# EAGLE design V2 (EAGLE 9.6.2)
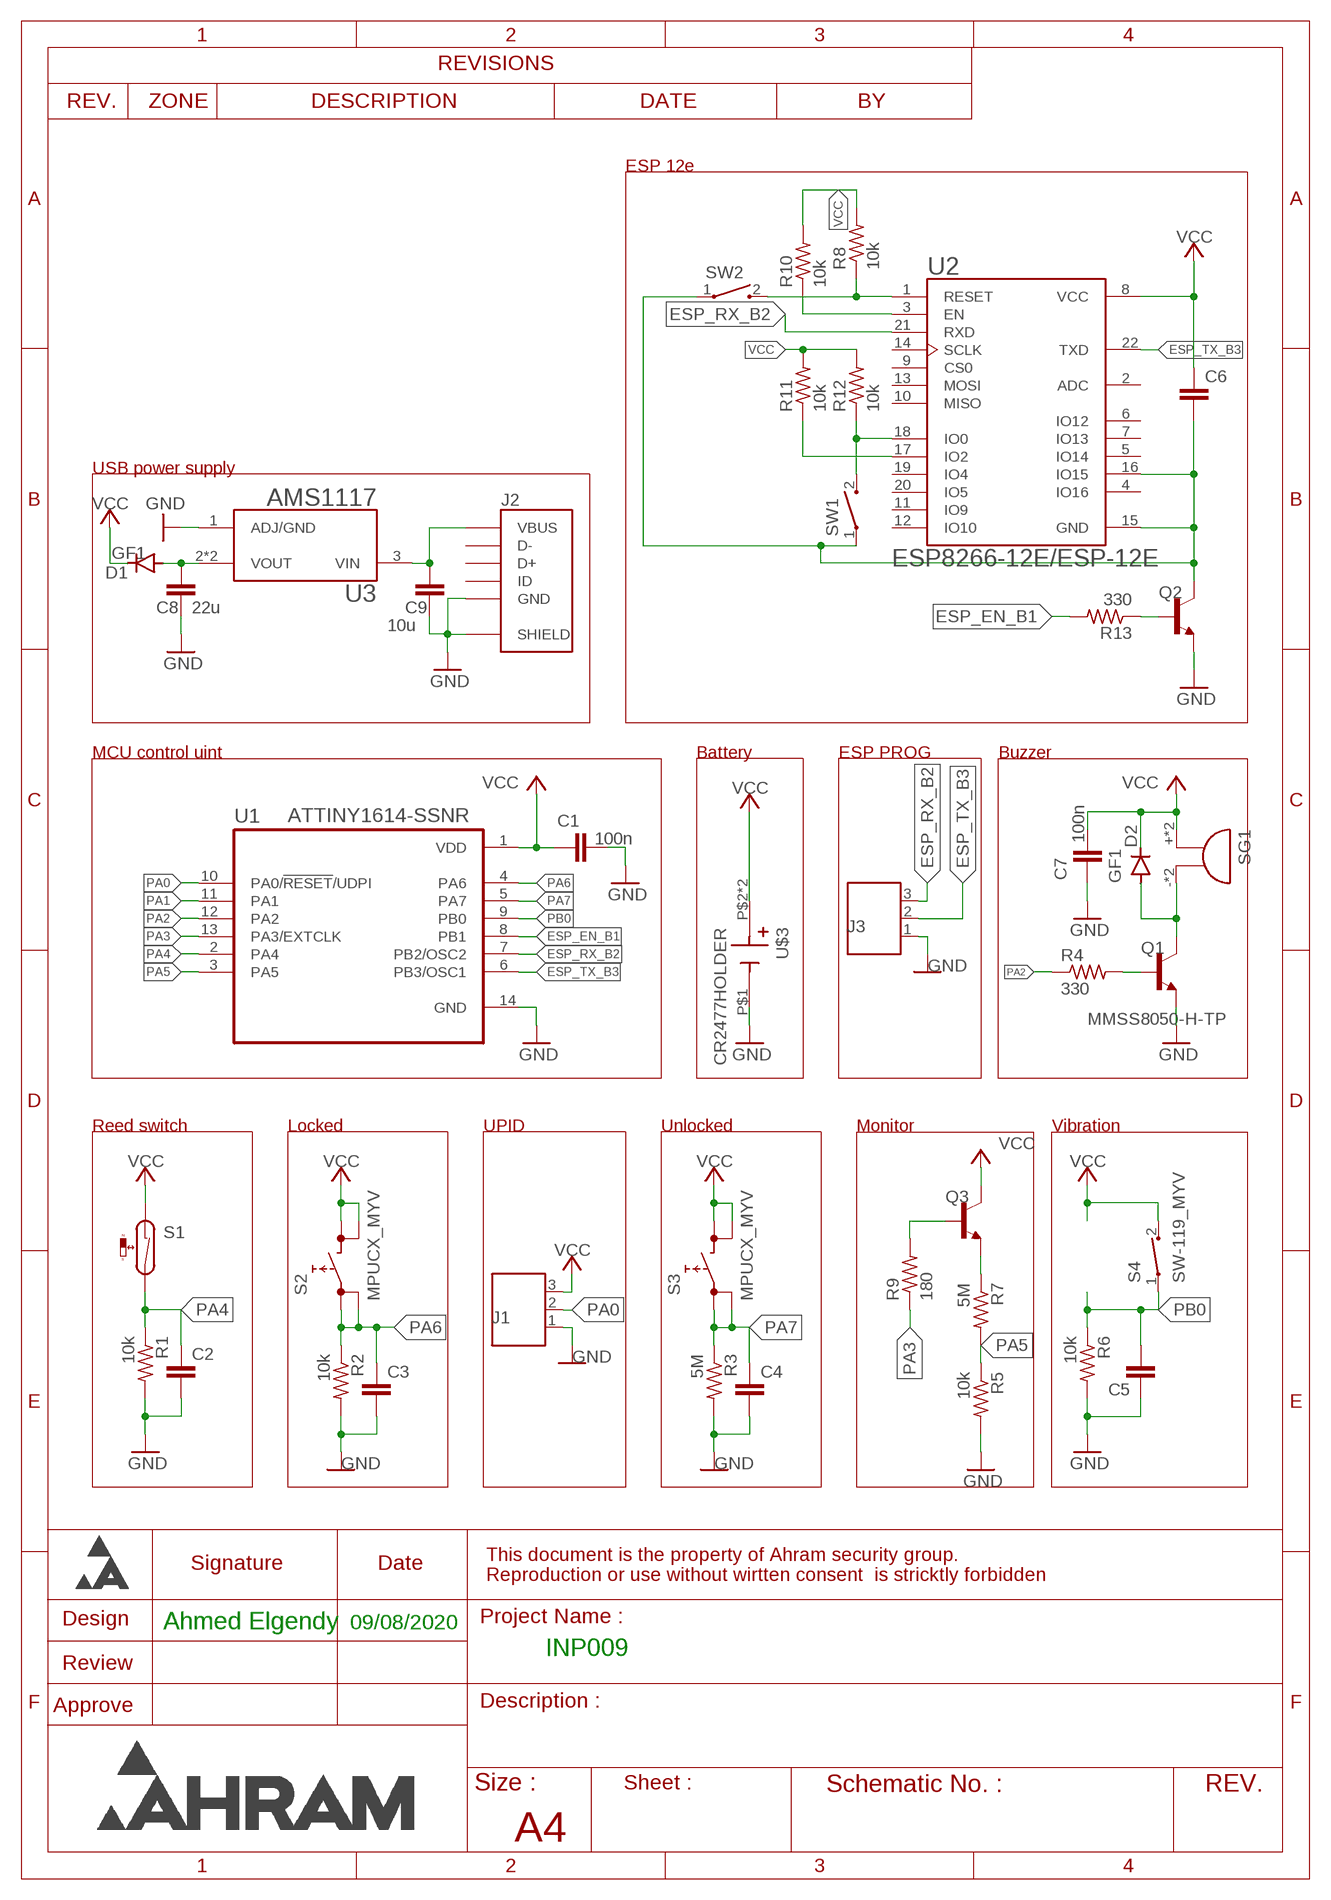
[diagram p0: schematic, sheet 1]

## Parts
C1  100n  C-EUC0805K  [C0805K]
C2  C-EUC0805K  [C0805K]
C3  C-EUC0805K  [C0805K]
C4  C-EUC0805K  [C0805K]
C5  C-EUC0805K  [C0805K]
C6  C-EUC0805K  [C0805K]
C7  100n  C-EUC0805K  [C0805K]
C8  22u  C-EUC0805K  [C0805K]
C9  10u  C-EUC0805K  [C0805K]
D1  GF1  [SMA-DO214AC]
D2  GF1  [SMA-DO214AC]
J1  691508110303  [691508110303]
J2  USB3065-XX-00-A_REVE  [GCT_USB3065-XX-00-A_REVE]
J3  691508110303  [691508110303]
Q1  MMSS8050-H-TP  [TRANS_MMSS8050-H-TP]
Q2  MMSS8050-H-TP  [TRANS_MMSS8050-H-TP]
Q3  MMSS8050-H-TP  [TRANS_MMSS8050-H-TP]
R1  10k  R-US_M0805  [M0805]
R2  10k  R-US_M0805  [M0805]
R3  5M  R-US_M0805  [M0805]
R4  330  R-US_M0805  [M0805]
R5  10k  R-US_M0805  [M0805]
R6  10k  R-US_M0805  [M0805]
R7  5M  R-US_M0805  [M0805]
R8  10k  R-US_M0805  [M0805]
R9  180  R-US_M0805  [M0805]
R10  10k  R-US_M0805  [M0805]
R11  10k  R-US_M0805  [M0805]
R12  10k  R-US_M0805  [M0805]
R13  330  R-US_M0805  [M0805]
S1  RI80SMDM-MYV  [RI80SMDM-0510-J1]
S2  MPUCX_MYV  [MPUCX_MYV]
S3  MPUCX_MYV  [MPUCX_MYV]
S4  SW-119_MYV  [SW-119]
SG1  CMI-9653S-SMT  [SMD_BUZZER]
SW1  1437566-3  [SW_1437566-3]
SW2  1437566-3  [SW_1437566-3]
U1  ATTINY1614-SSNR  [SOIC127P600X175-14N]
U2  ESP8266-12E/ESP-12E  [XCVR_ESP8266-12E/ESP-12E]
U3  AMS1117  [SOT229P700X180-4N]
U$3  CR2477HOLDER  [CR2477]

## Nets
ESP_EN_B1 [dd]: R13.2 U1.8(PB1)
ESP_RX_B2 [dd]: J3.3 U1.7(PB2/OSC2) U2.21(RXD)
ESP_TX_B3 [dd]: J3.2 U1.6(PB3/OSC1) U2.22(TXD)
GND [dd]: C1.2 C2.2 C3.2 C4.2 C5.1 C7.1 C8.1 C9.1 J1.1 J2.5(GND) J2.6(SHIELD) J2.7(SHIELD) J2.8(SHIELD) J2.9(SHIELD) J3.1 Q1.2(E) Q2.2(E) R1.2 R2.2 R3.2 R5.2 R6.2 U1.14(GND) U3.1(ADJ/GND) U$3.P$1(-)
N$2 [dd]: D2.A Q1.3(C) SG1.- SG1.--(-)
N$3 [dd]: C9.2 J2.1(VBUS) U3.3(VIN)
N$4 [dd]: Q1.1(B) R4.2
N$5 [dd]: C8.2 D1.A U3.2(VOUT) U3.4(VOUT)
N$6 [dd]: Q3.1(B) R9.2
N$7 [dd]: Q2.1(B) R13.1
N$8 [dd]: C6.2 Q2.3(C) SW1.1 SW2.1 U2.15(GND) U2.16(IO15)
N$9 [dd]: R12.1 SW1.2 U2.18(IO0)
N$10 [dd]: R11.1 U2.17(IO2)
N$11 [dd]: R10.1 U2.3(EN)
N$12 [dd]: R8.1 SW2.2 U2.1(RESET)
NS3 [dd]: Q3.2(E) R7.1
PA0 [dd]: J1.2 U1.10(PA0/!RESET!/UDPI)
PA1 [dd]: U1.11(PA1)
PA2 [dd]: R4.1 U1.12(PA2)
PA3 [dd]: R9.1 U1.13(PA3/EXTCLK)
PA4 [dd]: C2.1 R1.1 S1.P$2 U1.2(PA4)
PA5 [dd]: R5.1 R7.2 U1.3(PA5)
PA6 [dd]: C3.1 R2.1 S2.1 S2.2 U1.4(PA6)
PA7 [dd]: C4.1 R3.1 S3.1 S3.2 U1.5(PA7)
PB0 [dd]: C5.2 R6.1 S4.1 U1.9(PB0)
VCC [dd]: C1.1 C6.1 C7.2 D1.K(C) D2.K(C) J1.3 Q3.3(C) R8.2 R10.2 R11.2 R12.2 S1.P$1 S2.3 S2.4 S3.3 S3.4 S4.2 SG1.+ SG1.++(+) U1.1(VDD) U2.8(VCC) U$3.P$2(+) U$3.P$3(+)
Unconnected: J2.2(D-) J2.3(D+) J2.4(ID) U2.2(ADC) U2.4(IO16) U2.5(IO14) U2.6(IO12) U2.7(IO13) U2.9(CS0) U2.10(MISO) U2.11(IO9) U2.12(IO10) U2.13(MOSI) U2.14(SCLK) U2.19(IO4) U2.20(IO5)

## Notes on the sheet
- ESP 12e
- USB power supply
- MCU control uint | Battery | ESP PROG | Buzzer
- Reed switch | Locked | UPID | Unlocked | Monitor | Vibration
- Ahmed Elgendy | 09/08/2020
- INP009

## Library data of the parts
C1-C9 = rcl:C-EU: CAPACITOR, European symbol; SPICEPREFIX: C
D1 D2 = diode:GF1: DIODE
J1 J3 = Wurth_Elektronik_Electromechanic_Terminal_Blocks_Connectors_rev16b:691508110303: WR-TBL Terminal block - serie 5081 - 3 Pins;=>Code : Con_TBL_Screw_PClamp_3.50_6915081103xx_691508110303 <http://katalog.we-online.de/media/images/eican/Con_TBL_Screw_PClamp_3.50_6915081103xx_pf2.jpg> Details see: http://katalog.we-online.de/em/datasheet/6915081103xx.pdf Created 11/3/2014, Karrer Zheng 2014 (C) Wurth Elektronik
J2 = USB3065-XX-00-A_REVE:USB3065-XX-00-A_REVE: Micro USB Receptacle, Type B, 5 Pin, SMT, Horizontal, Bottom Mount (Standart), Optional Plastic Locating Peg; AVAILABILITY: Unavailable; DESCRIPTION: USB3065 Series 5 Pin, SMT, Horizontal, Bottom Mount, Micro USB Receptacle; MF: Global Connector Technology; MP: USB3065-30-00-A; PACKAGE: None; PRICE: None
Q1-Q3 = MMSS8050-H-TP:MMSS8050-H-TP: MMSS8050-H Series 25 V 1.5 A NPN Silicon Plastic-Encapsulate Transistor-SOT-23; AVAILABILITY: Unavailable; DESCRIPTION: Bipolar _BJT_ Transistor NPN 25V 1.5A 100MHz 625mW Surface Mount SOT-23; MF: Micro Commercial; MP: MMSS8050-H-TP; PACKAGE: SOT-23 Micro Commercial; PRICE: None
R1-R13 = rcl:R-US_: RESISTOR, American symbol; SPICEPREFIX: R
S1 = reed_MYV:RI80SMDM-MYV
S2 S3 = shouhan_BP:MPUCX_MYV
S4 = sw-119_MYV:SW-119_MYV
SG1 = CUI audio device:CMI-9653S-SMT
SW1 SW2 = 1437566-3:1437566-3: Switch Tactile OFF (ON) SPST Rectangular Button Gull Wing 0.05A 12VDC SMD Loose Piece Check prices <https://pricing.snapeda.com/parts/1437566-3/TE%20Connectivity/view-part?ref=eda>; AVAILABILITY: Warning; COMMENT: 1437566-3; CONFIGURATION_POLE-THROW: Single Pole - Single Throw; CONTACT_CURRENT_RATING: 50 mA; DESCRIPTION: Tactile Switch SPST-NO Top Actuated Surface Mount; MF: TE Connectivity; MP: 1437566-3; PACKAGE: None; PRICE: None
U1 = ATTINY1614-SSNR:ATTINY1614-SSNR: 20MHz, SOIC, 85C, Green, 14 SOIC .150in T/R; ARROW_ELECTRONICS-PURCHASE-URL: https://snapeda.com/shop?store=Arrow+Electronics&id=4817174; AVAILABILITY: Unavailable; DESCRIPTION: IC MCU 8BIT 16KB FLASH 14SOIC; DIGIKEY-PURCHASE-URL: https://snapeda.com/shop?store=DigiKey&id=4817174; MF: Microchip Technology; MOUSER-PURCHASE-URL: https://snapeda.com/shop?store=Mouser&id=4817174; MP: ATTINY1614-SSNR; PACKAGE: None; PRICE: None
U2 = ESP8266-12E_ESP-12E:ESP8266-12E/ESP-12E: ESP-12E WiFi Module; AVAILABILITY: Unavailable; DESCRIPTION: This WiFi module has a 32-bit MCU micro and clock speeds supporting 80 MHz or 160 MHz. Supports the RTOS and integrated Wi-Fi MAC/BB/RF/PA/LNA, and has an on-board antenna.; MF: AI-Thinker; MP: ESP8266-12E/ESP-12E; PACKAGE: None; PRICE: None
U3 = AMS1117:AMS1117: Sot223/Pkg 1-Amp 5-Volt Low Drop Out Voltage Regulatator; AVAILABILITY: Unavailable; DESCRIPTION: UNO PLUS Arduino R3 Shield, Xbee Arduino IDE Wheeled Robotics Kit; MF: Seeed Technology; MP: AMS1117; PACKAGE: SOT-223 Seeed Technology; PRICE: None
U$3 = cr2477_MYV:CR2477HOLDER

## Net classes
0 default: width 0.254 mm, clearance 0.254 mm
1 dd: width 0.254 mm, clearance 0.254 mm

## Board
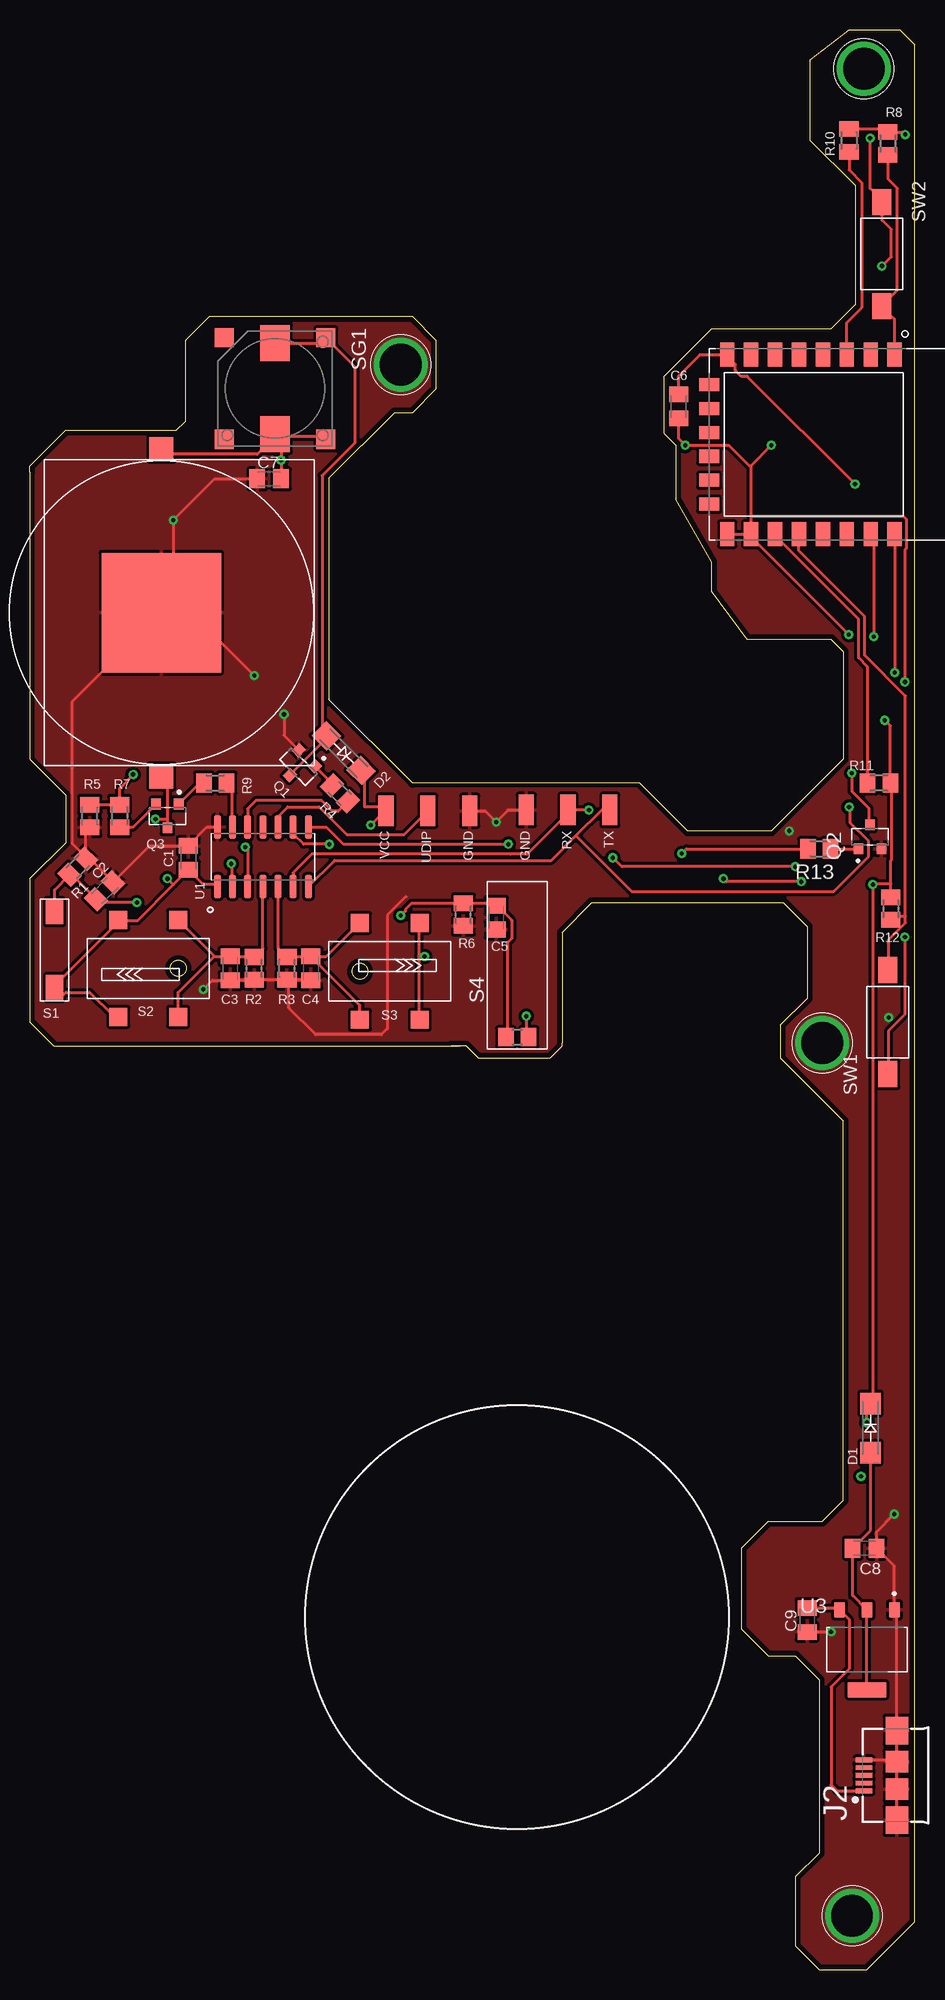
[diagram p1: board, top side]
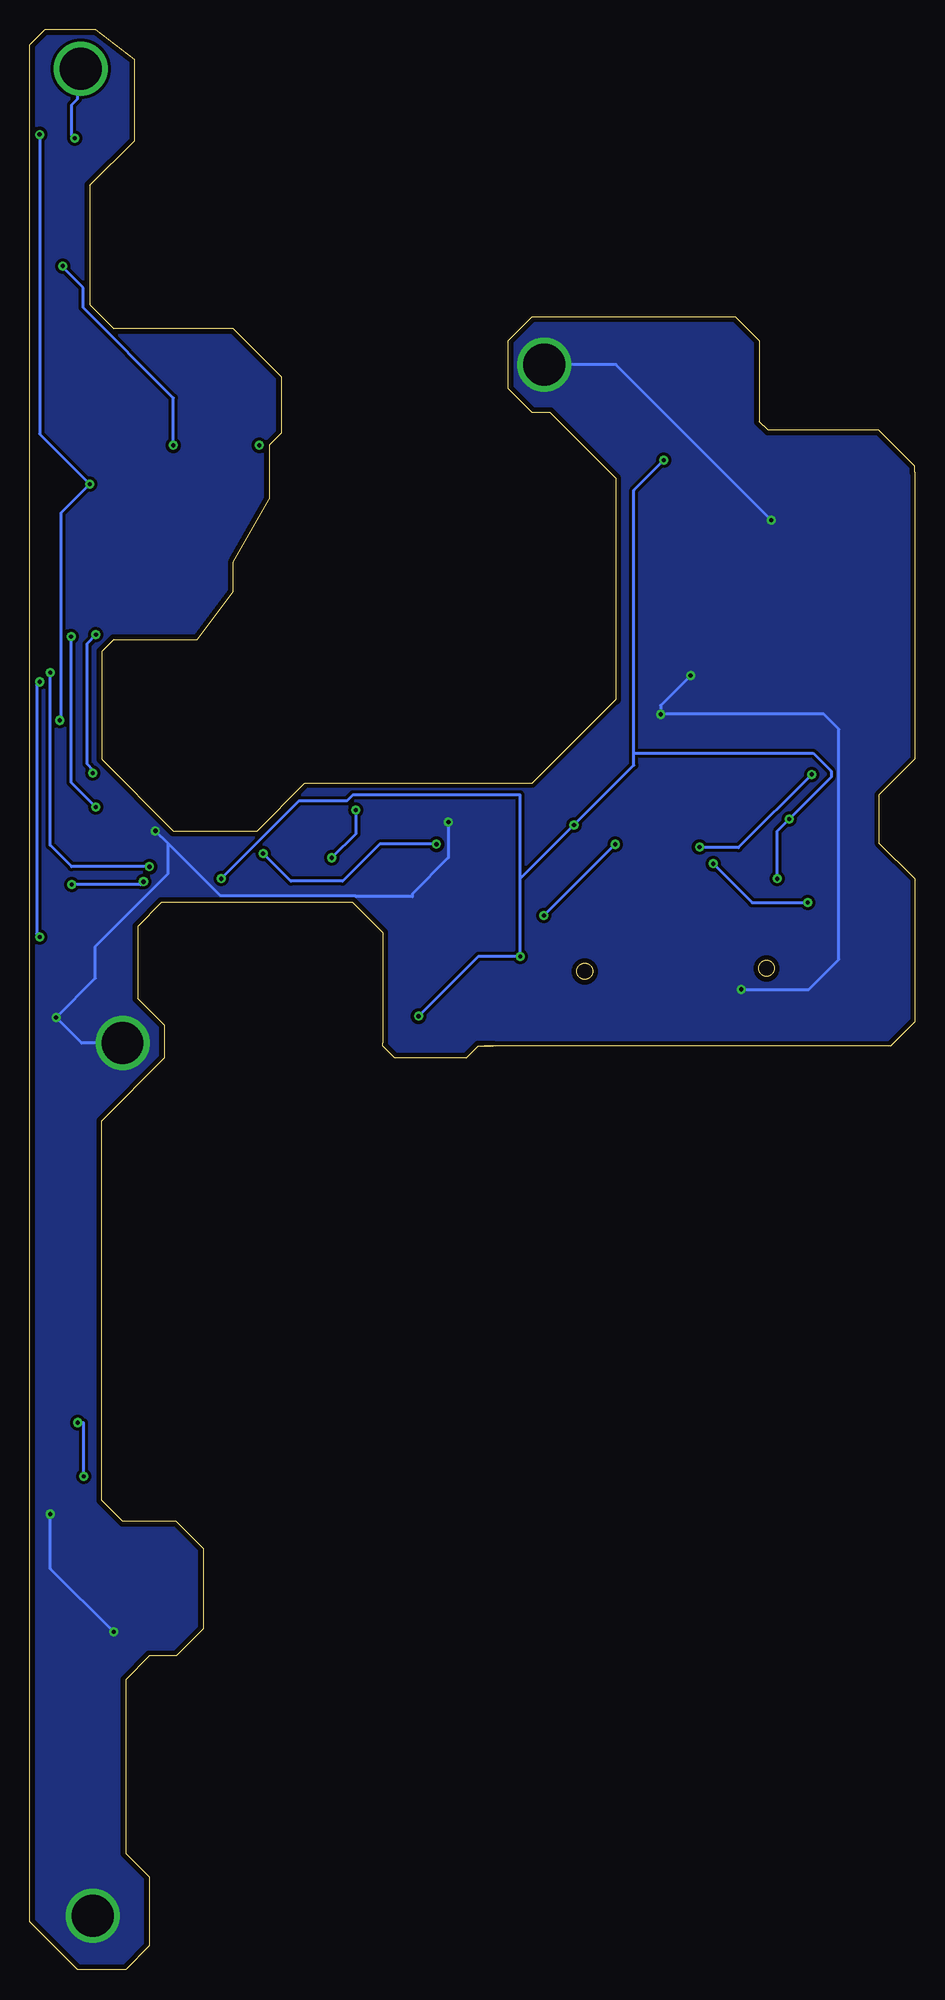
[diagram p2: board, bottom side, seen from below]

Size 74 x 162.25 mm. Coordinates in mm from the lower left corner, seen from the top.
Outline: 35.25,77.25 2,77.25 0,79.25 0,91.25 3,94.25 3,98.25 0,101.25 0,125.25 0,125.75 3,128.75 12.25,128.75 13,129.5 13,136.25 15,138.25 32,138.25 34,136.25 34,132.25 32,130.25 30.5,130.25 25,124.75 25,106.25 32,99.25 51,99.25 55,95.25 62,95.25 68,101.25 68,110.25 67,111.25 60,111.25 57,115.25 57,117.75 54,123 54,127.5 53,128.5 53,133.25 57,137.25 67,137.25 69,139.25 69,149.25 65.25,153 65.25,159.75 68.5,162.25 72.75,162.25 74,161 74,4 70,0 66,0 64,2 64,7.75 66,9.75 66,24.25 64,26.25 61.75,26.25 59.5,28.5 59.5,35.25 61.75,37.5 66.25,37.5 68,39.25 68,71 62.75,76.25 62.75,79 65,81.25 65,87.25 63,89.25 47,89.25 44.5,86.75 44.5,77.5 44.5,77.25 43.5,76.25 43.25,76.25 37.5,76.25 36.5,77.25 35.25,77.25
Outline: 35.25,77.25 36,77.25
Outline: circle at 12.4,83.75 radius 0.65
Outline: circle at 27.6,83.5 radius 0.65
Copper layers (1*16): Top 0.035mm / dielectric 1.5mm / Bottom 0.035mm
Design rules "default *": minimum track width 10mil, minimum drill 0.35mm, track to track 10mil, track to pad 10mil, pad to pad 10mil, via to via 10mil, smd to smd 10mil, copper to edge 15mil, drill to drill 10mil, minimum pad ring 10mil, minimum via ring 8mil, stop-mask expansion 4mil, vias tented up to drill 0mil, thermal gap 10mil

### Footprints (pad centres in the part's own frame; a part is rotated, then mirrored left to right if it is on the bottom)
C0805K = smd 1.3 x 1.6: 1 -1,0; 2 1,0
SMA-DO214AC = smd 1.8 x 1.7: A -2.05,0; K 2.05,0
691508110303 = smd 1.27 x 2.54: 1 -3.5,0; 2 0,0; 3 3.5,0
GCT_USB3065-XX-00-A_REVE = smd 0.4 x 1.4: 1 -1.3,0.5; 2 -0.65,0.5; 3 0,0.5; 4 0.65,0.5; 5 1.3,0.5 | smd 1.8 x 1.9: 6 1.15,-2.25; 7 -1.15,-2.25 | smd 2.3 x 1.9: 8 3.75,-2.25; 9 -3.75,-2.25
TRANS_MMSS8050-H-TP = smd 0.9 x 0.8: 1 -1,0.95; 2 -1,-0.95; 3 1,0
M0805 = smd 1.3 x 1.6: 1 -0.95,0; 2 0.95,0
RI80SMDM-0510-J1 = smd 2.1 x 1.45: P$1 -3,0; P$2 3.35,0
MPUCX_MYV = smd 1.5 x 1.5: 1 0.1,1.55; 2 0.1,-6.55; 3 5.1,1.55; 4 5.1,-6.55
SW-119 = smd 1.3 x 1.5: 1 -0.95,0; 2 0.95,0
SMD_BUZZER = smd 3 x 2.5: + 3.8,0; - -3.8,0 | smd 1.6 x 1.6: ++ 4.25,4.25; -- -4.25,4.25; N 4.25,-4.25; NC -4.25,-4.25
SW_1437566-3 = smd 2.18 x 1.6: 1 -4.346,0; 2 4.346,0
SOIC127P600X175-14N = smd 1.95 x 0.59: 1 -2.48,3.81; 2 -2.48,2.54; 3 -2.48,1.27; 4 -2.48,0; 5 -2.48,-1.27; 6 -2.48,-2.54; 7 -2.48,-3.81; 8 2.48,-3.81; 9 2.48,-2.54; 10 2.48,-1.27; 11 2.48,0; 12 2.48,1.27; 13 2.48,2.54; 14 2.48,3.81
XCVR_ESP8266-12E/ESP-12E = smd 2 x 1.2: 1 -7.5,7; 2 -7.5,5; 3 -7.5,3; 4 -7.5,1; 5 -7.5,-1; 6 -7.5,-3; 7 -7.5,-5; 8 -7.5,-7; 15 7.5,-7; 16 7.5,-5; 17 7.5,-3; 18 7.5,-1; 19 7.5,1; 20 7.5,3; 21 7.5,5; 22 7.5,7 | smd 1.1 x 1.7: 9 -5,-8.5; 10 -3,-8.5; 11 -1,-8.5; 12 1,-8.5; 13 3,-8.5; 14 5,-8.5
SOT229P700X180-4N = smd 1.31 x 0.93: 1 -3.345,2.29; 2 -3.345,0; 3 -3.345,-2.29 | smd 1.31 x 3.24: 4 3.345,0
CR2477 = smd 10 x 10: P$1 0,0 | smd 2 x 2: P$2 13.7,0; P$3 -13.7,0

### Placement (x,y rotation side)
C1  13.25,93 90 top
C2  6.25,90.25 45 top
C3  16.75,83.75 270 top
C4  23.5,83.75 270 top
C5  39,88 90 top
C6  54.25,130.75 270 top
C7  20,124.7 0 top
C8  69.8,35.25 180 top
C9  65,29.25 90 top
D1  70.3,45.3 90 top
D2  26.25,101.75 315 top
J1  33.28,96.93 180 top
J2  70.25,16.25 90 top
J3  45,97 0 top
Q1  22.45,100.62 225 top
Q2  70.25,94.75 90 top
Q3  11.5,96.5 270 top
R1  4,92.25 45 top
R2  18.75,83.75 270 top
R3  21.5,83.75 270 top
R4  25.92,98.39 135 top
R5  5,96.5 270 top
R6  36.25,88.25 270 top
R7  7.5,96.5 90 top
R8  71.75,152.75 90 top
R9  15.5,99.25 180 top
R10  68.5,153 90 top
R11  71,99.25 0 top
R12  72,88.75 90 top
R13  66,93.75 180 top
S1  2.06,85.14 90 top
S2  12.5,81.25 180 top
S3  27.5,86 0 top
S4  40.75,78 0 top
SG1  20.5,132.25 270 top
SW1  71.75,79.25 90 top
SW2  71.25,143.5 270 top
U1  19.48,93.08 90 top
U2  65.31,127.57 270 top
U3  70,26.75 270 top
U$3  11,113.5 90 top

### Tracks (layer width: path | path; a pad name or v marks a point on that pad's centre or on a via)
ESP_EN_B1  (via drill 0.35)
  Top 0.254: U1.8 24.79,95.56 26.22,94.13 v40,94.13 | R13.2 54.89,93.75 v54.51,93.37 v54.5,93.37
  Bottom 0.254: v40,94.13 44.75,94.13 47.84,91.04 52.17,91.04 v54.5,93.37
ESP_RX_B2  (via drill 0.35)
  Top 0.254: U1.7 25.47,92.78 43.61,92.78 45.67,94.84 | J3.3 47.82,97 45.67,94.84 | U2.21 70.56,119.82 v70.56,111.5 | 45.67,94.84 50.32,90.19 67.21,90.19 70.13,93.11 70.13,94.38 68.61,95.91 68.61,97.18 v68.5,97.25
  Bottom 0.254: v68.5,97.25 70.56,99.31 v70.56,111.5
ESP_TX_B3  (via drill 0.35)
  Top 0.254: U2.22 v72.31,108.5 | v64,92.25 49.5,92.25 v48.75,93 | v46.75,97 J3.2 45,96.73 41.58,93.31 40.2,93.31 40.19,93.29 23.56,93.29 22.02,91.75 U1.6
  Bottom 0.254: v72.31,108.5 72.31,94.06 70.5,92.25 v64,92.25 | v46.75,97 46.75,95 v48.75,93
GND  (via drill 0.35, 3.5)
  Top 0.254: J2.9 J2.7 J2.6 | 38.7,87.3 C5.1 | C9.1 v67,28.25 | v72.29,38.1 70.81,36.62 70.81,36.54 70.8,36.53 C8.1 72.29,33.76 U3.1 72.5,29.89 J2.8 J2.6 | J1.1 38.07,96.93 v39,96 40,97 J3.1 | v14.5,82 15.25,82.75 C3.2 18.7,82.75 R2.2 R3.2 21.65,82.8 | 21.65,82.8 23.45,82.8 C4.2 | C7.1 15.45,124.7 v12,121.25 12,114.5 U$3.P$1 | U$3.P$1 13.5,113.5 v18.75,108.25 | U$3.P$1 3.51,106.01 3.51,94.21 4.8,92.92 | U1.14 14.81,95.56 C1.2 10,94 C2.2 4.99,92.92 4.8,92.92 | v21.25,105 21.25,103.23 Q1.2 | J2.5 72.35,17.55 J2.6 | 31.45,89.75 29.9,88.2 29.9,78.7 29.4,78.2 23.9,78.2 21.65,80.45 21.65,82.8 | R5.2 4.67,95.22 R1.2 4.8,92.92
  Bottom 0.254: v67,28.25 72.29,33.54 v72.29,38.1 | v66.25,77.5 69.66,77.5 v71.81,79.65 68.53,82.93 68.53,85.59 62.45,91.66 62.45,94.2 | 62.45,94.2 v63.5,95.25 | v39,96 39,93 42,90 42,89.75 46.71,89.75 46.77,89.81 58.06,89.81 62.45,94.2 | v12,121.25 25,134.25 v31,134.25 | v18.75,108.25 21.25,105.75 v21.25,105 7.6,105 6.35,103.75 6.35,84.5 8.85,82 v14.5,82
  other vias: 68.75,4.5
  pour Top: 74,162.25 74,0 0,0 0,162.25
  pour Bottom: 74,162.25 74,-0.07 11.07,-0.07 11,0 0,0 0,162.25
N$2
  Top 0.254: SG1.- 24.3,136.05 SG1.-- 27.15,134.1 27.15,127.69 24.44,124.98 24.44,103.56 D2.A 24.8,102.97 Q1.3
N$3
  Top 0.254: C9.2 67.56,30.25 U3.3 68.5,29.31 68.5,25.15 67,23.65 67,15.45 67.5,14.95 J2.1
N$4
  Top 0.254: Q1.1 25.25,99.24 R4.2
N$5
  Top 0.254: U3.4 U3.2 68.8,31.3 C8.2 70.3,36.75 D1.A
N$6
  Top 0.254: Q3.1 14.2,99.25 R9.2
N$7
  Top 0.254: Q2.1 69.24,93.75 R13.1
N$8  (via drill 0.35, 3.5)
  Top 0.254: U2.15 U2.16 | U2.16 60.31,121.56 | 60.31,121.56 60.31,125.65 | 60.31,125.65 60.31,125.81 v62,127.5 | C6.2 54.25,128.06 v54.81,127.5 55.8,127.5 55.8,127.51 58.46,127.51 60.31,125.65 | v68.73,100.1 68.73,98.57 70.13,97.18 70.13,95.78 Q2.3 | v68.48,111.66 60.1,120.04 U2.16 | v73.18,86.38 73.18,79.91 71.78,78.51 71.78,74.95 SW1.1 | v73.18,107.72 73.18,118.77 73.31,118.9 73.31,121.31 73.05,121.56 60.31,121.56 | v71.25,142.5 71.27,142.52 72.03,143.28 72.03,145.56 71.27,146.33 71.27,147.72 SW2.1 71.27,147.98 70.26,148.99 v70.26,153.19
  Bottom 0.254: v62,127.5 62,131.46 69.56,139.02 69.56,140.68 71.15,142.26 71.15,142.39 v71.25,142.5 | 70.05,158.7 v69.75,159 70,158.65 70,156.49 70.51,155.98 70.51,153.44 v70.26,153.19 | v68.73,100.1 68.73,100.35 69.24,100.86 69.24,110.89 v68.48,111.66 | v73.18,86.38 73.43,86.64 73.43,107.47 v73.18,107.72
N$9
  Top 0.254: R12.1 72.33,88.13 73.21,88.13 | U2.18 64.31,118.67 69.8,113.18 69.8,109.94 73.21,106.53 73.21,88.13 | 73.21,88.13 73.21,87.54 72,86.34 71.91,86.26 71.78,86.13 71.78,83.72 SW1.2
N$10
  Top 0.254: R11.1 70.05,108.97 69.29,109.72 69.29,112.95 62.31,119.94 U2.17
N$11
  Top 0.254: R10.1 68.5,150.54 69.56,149.48 69.56,139.02 68.31,137.77 U2.3
N$12
  Top 0.254: R8.1 71.78,151.79 71.78,149.76 72.54,148.99 72.54,140.49 71.27,139.22 SW2.2 71.27,139.09 72.29,138.07 72.29,135.15 U2.1
NS3
  Top 0.254: Q3.2 8.6,95.55 R7.1
PA0
  Top 0.254: U1.10 20.75,96.46 21.55,97.26 24.19,97.26 26.5,94.95 31.3,94.95 J1.2
PA2
  Top 0.254: R4.1 25.77,96.9 25.27,96.9 24.4,97.77 18.87,97.77 18.21,97.11 U1.12
PA3
  Top 0.254: U1.13 16.94,98.76 R9.1
PA4  (via drill 0.35)
  Top 0.254: S1.P$2 2.06,90.31 R1.1 3.51,91.58 C2.1 5.84,89.25 v8.95,89.25 | U1.2 16.94,92.41 v16.85,92.5
  Bottom 0.254: v16.85,92.5 13.6,89.25 v8.95,89.25
PA5  (via drill 0.35)
  Top 0.254: R5.1 R7.2 7.5,98.8 8.65,99.95 v8.62,99.97 | v18,93.9 18.21,93.69 U1.3
  Bottom 0.254: v8.62,99.97 14.75,93.85 18,93.85 v18,93.9
PA6
  Top 0.254: S2.1 12.4,81.75 15.4,84.75 C3.1 | S2.2 15.45,84.75 C3.1 | C3.1 18.7,84.75 R2.1 19.48,85.43 U1.4
PA7
  Top 0.254: U1.5 20.75,85.45 R3.1 21.55,84.75 C4.1 | C4.1 24.8,84.75 S3.1 | S3.2 27.6,80.65 C4.1
PB0  (via drill 0.35)
  Top 0.254: S4.1 39.9,78 39.9,85.88 40.28,86.26 40.28,87.78 39.02,89.05 C5.2 39.02,89.18 36.35,89.18 R6.1 36.22,89.18 31.9,89.18 31.39,88.67 31.39,88.54 v31.01,88.16 | v25.05,94.13 22.89,94.13 22.12,94.89 22.12,95.53 U1.9
  Bottom 0.254: v31.01,88.16 v25.05,94.13
VCC  (via drill 0.35)
  Top 0.254: v70,45.75 70,47.25 D1.K 70.5,47.75 v70.5,90.75 70.51,90.83 72,90.83 | 11.5,96.25 11.5,99.75 11,99.75 U$3.P$3 | 11.5,96.25 Q3.3 | U1.1 15.5,90.75 14.5,90.75 C1.1 12,90.75 | S2.3 7,79.75 5,81.75 3,81.75 2.5,81.25 2,81.75 S1.P$1 2,82.25 7,87.25 7,87.75 S2.4 7.5,87.75 9,87.75 12,90.75 | v10.5,96.25 11.5,96.25 | 12,90.75 v11.5,91.25 | 21,128.25 v21,126.25 C7.2 | 20.5,128.25 21,128.25 | 21,128.25 24.5,128.25 SG1.++ | 21,128.25 SG1.+ 20.5,128.25 | 20.5,128.25 19,126.75 11,126.75 U$3.P$2 | D2.K 28,100.25 28,97.25 29.5,97.25 J1.3 29.5,96.75 v28.5,95.75 | 32.5,84.75 32.5,87.5 S3.3 | 32.5,84.75 32.5,79.5 S3.4 | v41.5,79.75 41.5,78.25 S4.2 | 32.5,84.75 v33,84.75 | v64.5,91 58.25,91 v58,91.25 | C6.1 54.25,133.3 56.05,135.1 58.28,135.1 U2.8 58.5,134.75 59,134.25 59,133.75 59.5,133.25 60,133.25 v69,124.25 | R12.2 72,90.83 | 72,90.83 72,92.75 72.03,92.86 72.03,98.57 72.29,98.83 R11.2 71.95,104.05 v71.5,104.5 | R10.2 71.5,153.95 R8.2 72.99,153.7 v73.19,153.5
  Bottom 0.254: v69.5,41.25 69.5,45.75 v70,45.75 | v11.5,91.25 11.5,95.25 v10.5,96.25 7,99.75 7,100.25 8.5,101.75 23.5,101.75 | v41.5,79.75 36.5,84.75 v33,84.75 33,91.25 | 33,91.25 v28.5,95.75 23.5,100.75 23.5,101.75 | v21,126.25 23.5,123.75 23.5,101.75 | v70.5,90.75 64.75,90.75 v64.5,91 | v58,91.25 51.5,97.75 47.5,97.75 47,98.25 33,98.25 33,91.25 | v71.5,104.5 71.41,104.59 71.41,121.84 v69,124.25 73.19,128.44 v73.19,153.5

### Text on the board
tNames: VCC | UDIP | GND | GND | RX | TX